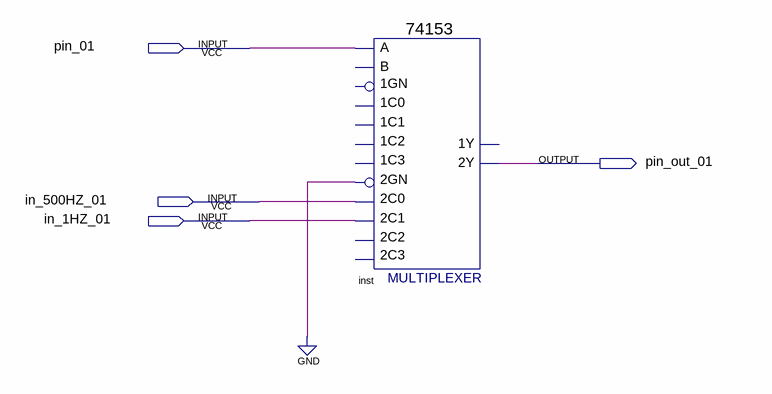
[diagram p0: schematic sheet]
// Quartus schematic tiaop.bdf as structural Verilog: 1 symbols, 4 pins
module tiaop (
  input  pin_01,
  input  in_500HZ_01,
  input  in_1HZ_01,
  output pin_out_01
);

  \74153  inst (
    .\2C0 (in_500HZ_01), .\2GN (1'b0), .A(pin_01), .\2C1 (in_1HZ_01), .\2Y (pin_out_01));  // open: 1C1, 1GN, 1C0, 2C2, 1C2, 1C3, B, 2C3, 1Y
endmodule
